# EAGLE design Teensy_Intan_Module_JE_T36_v01_20180628 (EAGLE 9.0.1)
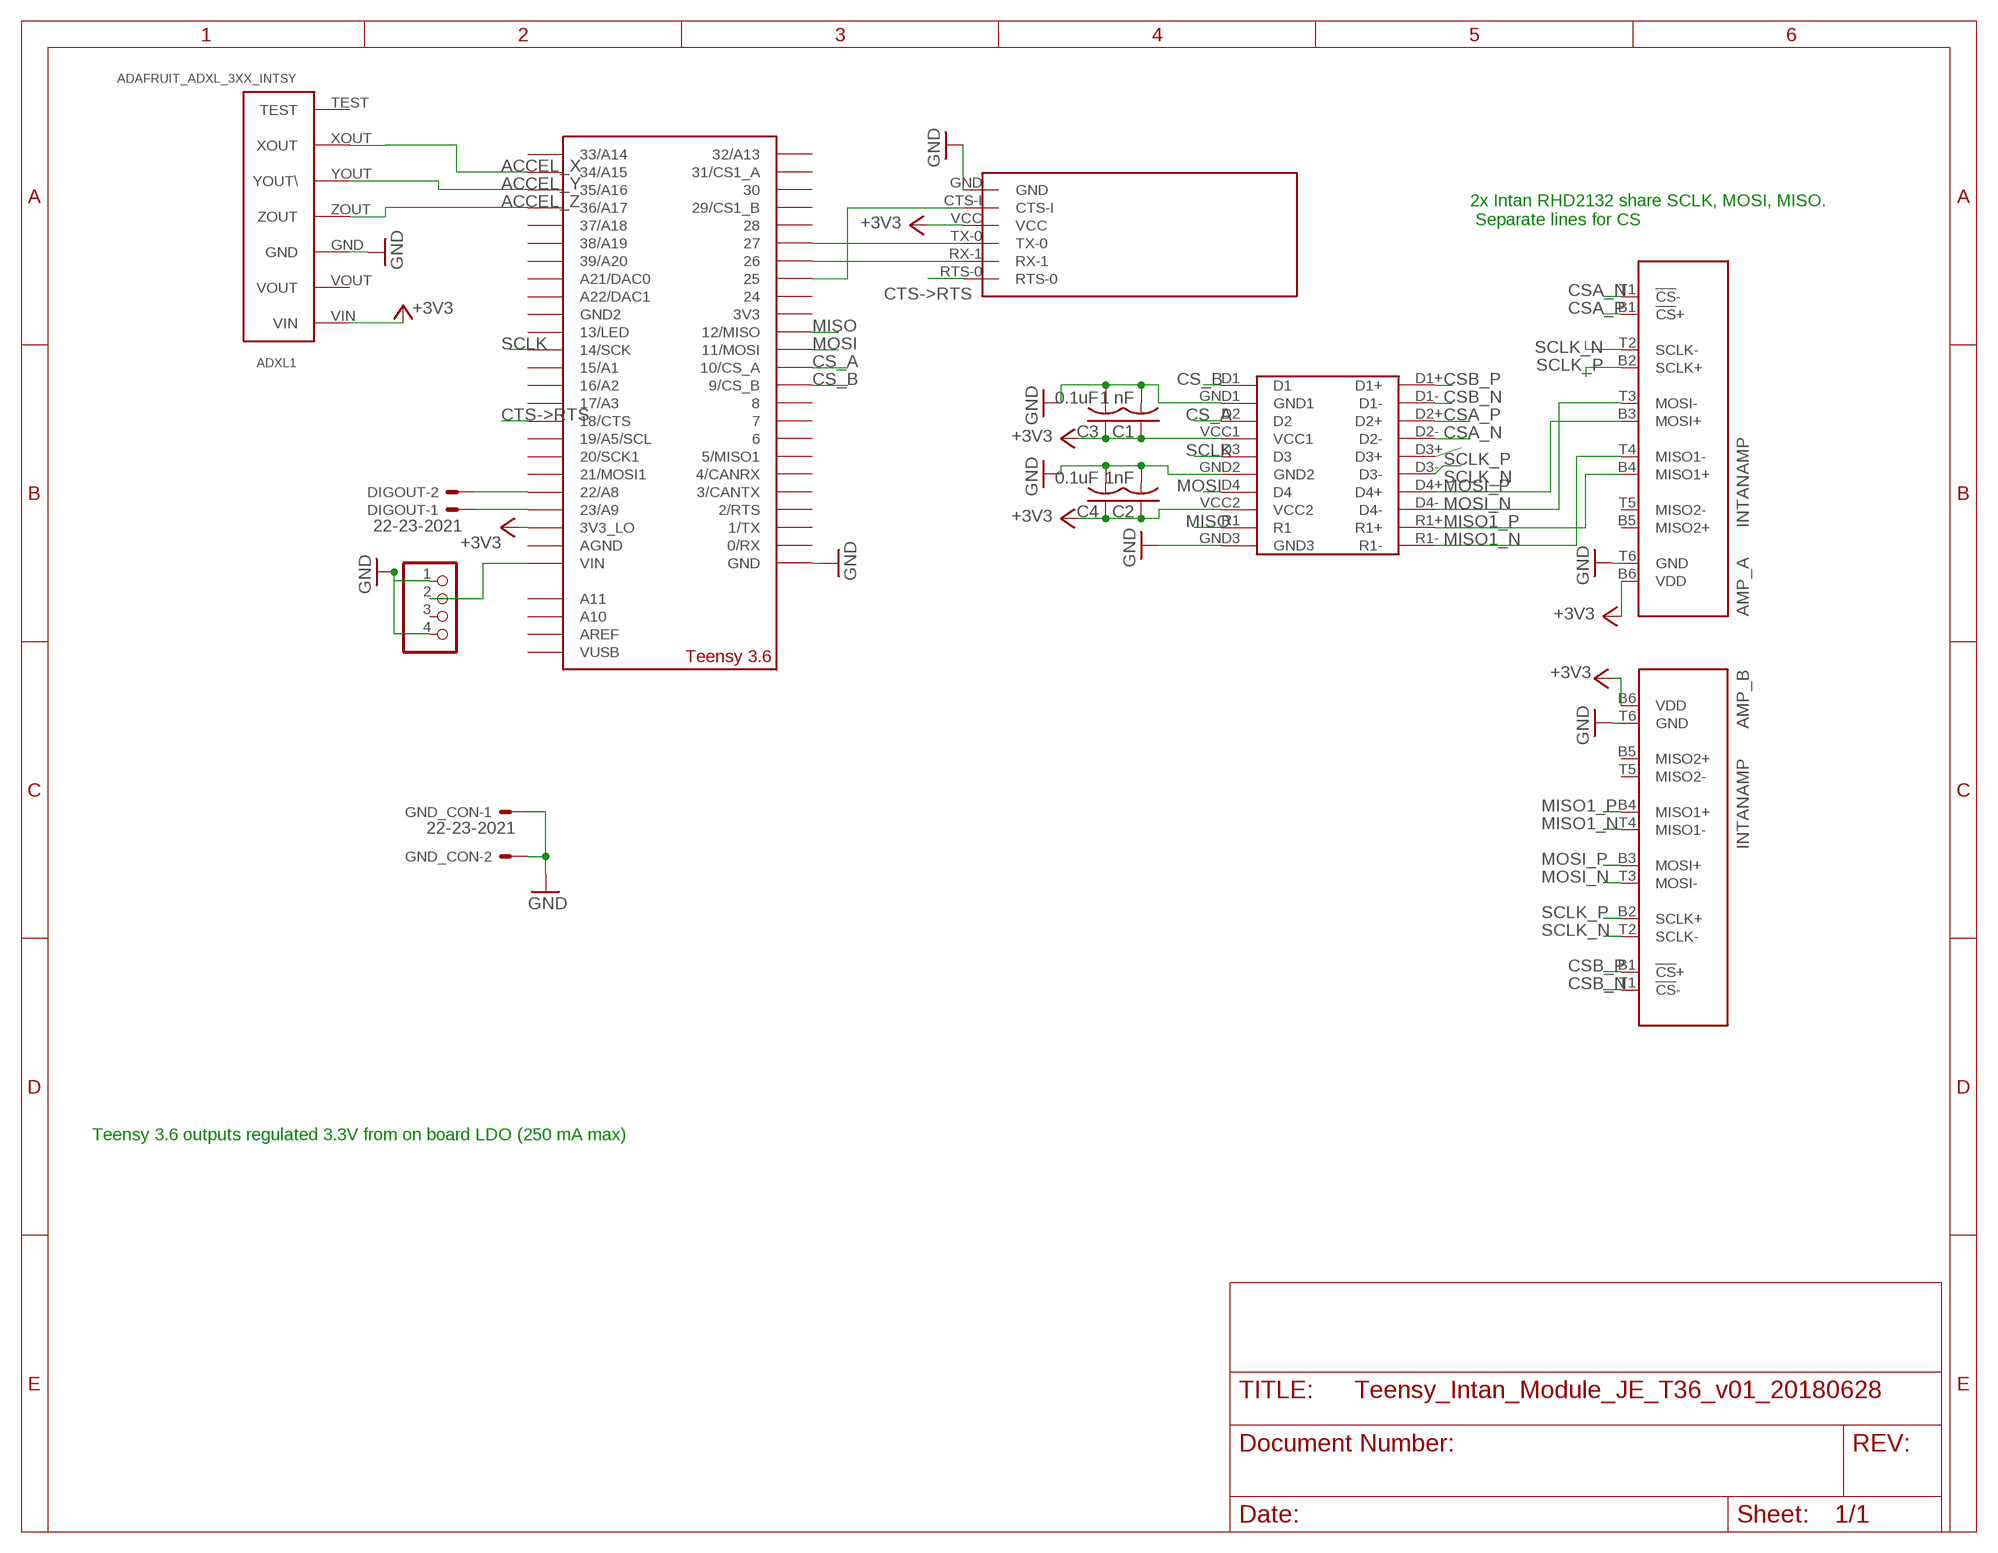
[diagram p0: schematic, sheet 1]

## Parts
ADXL1  ADAFRUIT_ADXL_3XX_INTSY  [ADAFRUIT_ADXL_3XX]
AMP_A  INTANAMP  [AMPBOARD]
AMP_B  INTANAMP  [AMPBOARD]
C1  1 nF  C-US025-024X044  [C025-024X044]
C2  1nF  C-US025-024X044  [C025-024X044]
C3  0.1uF  C-US025-024X044  [C025-024X044]
C4  0.1uF  C-US025-024X044  [C025-024X044]
DIGOUT  22-23-2021  [22-23-2021]
GND_CON  22-23-2021  [22-23-2021]
RN42  RN42  [RN42]
SW1  LiPoIn  PADS-4  [PADS-4]
U$1  SCHMARTBOARD20PIN  [SCHMARTBOARD20PIN]
U$2  TEENSY_3.5/3.6_BASIC  [TEENSY_3.5/3.6_BASIC]

## Nets
+3V3: ADXL1.VIN AMP_A.B6(VDD) AMP_B.B6(VDD) C1.1 C2.1 C3.1 C4.1 RN42.VCC U$1.VCC1 U$1.VCC2 U$2.3V3_LO
ACCEL_X: ADXL1.XOUT U$2.34/A15
ACCEL_Y: ADXL1.YOUT(YOUT\) U$2.35/A16
ACCEL_Z: ADXL1.ZOUT U$2.36/A17
CS_A: U$1.D2 U$2.10/CS(10/CS_A)
CS_B: U$1.D1 U$2.9/CS(9/CS_B)
CSA_N: AMP_A.T1(!CS!-) U$1.D2-
CSA_P: AMP_A.B1(!CS!+) U$1.D2+
CSB_N: AMP_B.T1(!CS!-) U$1.D1-
CSB_P: AMP_B.B1(!CS!+) U$1.D1+
CTS->RTS: RN42.RTS-0 U$2.18/A4/SDA(18/CTS)
GND: ADXL1.GND AMP_A.T6(GND) AMP_B.T6(GND) C1.2 C2.2 C3.2 C4.2 GND_CON.1 GND_CON.2 RN42.GND SW1.1 SW1.4 U$1.GND1 U$1.GND2 U$1.GND3 U$2.GND
MISO: U$1.R1 U$2.12/MISO
MISO1_N: AMP_A.T4(MISO1-) AMP_B.T4(MISO1-) U$1.R1-
MISO1_P: AMP_A.B4(MISO1+) AMP_B.B4(MISO1+) U$1.R1+
MOSI: U$1.D4 U$2.11/MOSI
MOSI_N: AMP_A.T3(MOSI-) AMP_B.T3(MOSI-) U$1.D4-
MOSI_P: AMP_A.B3(MOSI+) AMP_B.B3(MOSI+) U$1.D4+
N$1: SW1.2 U$2.VIN
N$3: DIGOUT.2 U$2.22/A8
N$4: DIGOUT.1 U$2.23/A9
N$5: RN42.TX-0 U$2.27
N$6: RN42.RX-1 U$2.26
N$7: RN42.CTS-I U$2.25
SCLK: U$1.D3 U$2.14/A0(14/SCK)
SCLK_N: AMP_A.T2(SCLK-) AMP_B.T2(SCLK-) U$1.D3-
SCLK_P: AMP_A.B2(SCLK+) AMP_B.B2(SCLK+) U$1.D3+
Unconnected: ADXL1.TEST ADXL1.VOUT AMP_A.B5(MISO2+) AMP_A.T5(MISO2-) AMP_B.B5(MISO2+) AMP_B.T5(MISO2-) SW1.3 U$2.0/RX U$2.1/TX U$2.2(2/RTS) U$2.3/CANTX U$2.3V3 U$2.4/CANRX U$2.5(5/MISO1) U$2.6 U$2.7 U$2.8 U$2.13/SCK(13/LED) U$2.15/A1 U$2.16/A2 U$2.17/A3 U$2.19/A5/SCL U$2.20/A6(20/SCK1) U$2.21/A7(21/MOSI1) U$2.21/DAC0(A21/DAC0) U$2.24 U$2.28 U$2.29(29/CS1_B) U$2.30 U$2.31/A12(31/CS1_A) U$2.32/A13 U$2.33/A14 U$2.37/A18 U$2.38/A19 U$2.39/A20 U$2.A10 U$2.A11 U$2.A22/DAC1 U$2.AGND U$2.AREF U$2.GND2 U$2.VUSB

## Notes on the sheet
- 2x Intan RHD2132 share SCLK, MOSI, MISO.
   Separate lines for CS
- Teensy 3.6 outputs regulated 3.3V from on board LDO (250 mA max)

## Library data of the parts
ADXL1 = adafruit_ADXL3xx_Intsy:ADAFRUIT_ADXL_3XX_INTSY: Bare bones 0.1" header row connector to plug in adafruit ADXL3xx module into a larger system (Intsy), for example, product 1018: https://www.adafruit.com/product/1018
AMP_A AMP_B = INTANAMP:INTANAMP
C1-C4 = adafruit:C-US: CAPACITOR, American symbol
DIGOUT GND_CON = con-molex:22-23-2021: .100" (2.54mm) Center Header - 2 Pin; MF: MOLEX; MPN: 22-23-2021; OC_FARNELL: 1462926; OC_NEWARK: 25C3832
RN42 = BLUETOOTH_MODULES:RN42
SW1 = breakouts:PADS-4: PIN HEADER
U$1 = schmart:SCHMARTBOARD20PIN
U$2 = Teensy356:TEENSY_3.5/3.6_BASIC

## Board
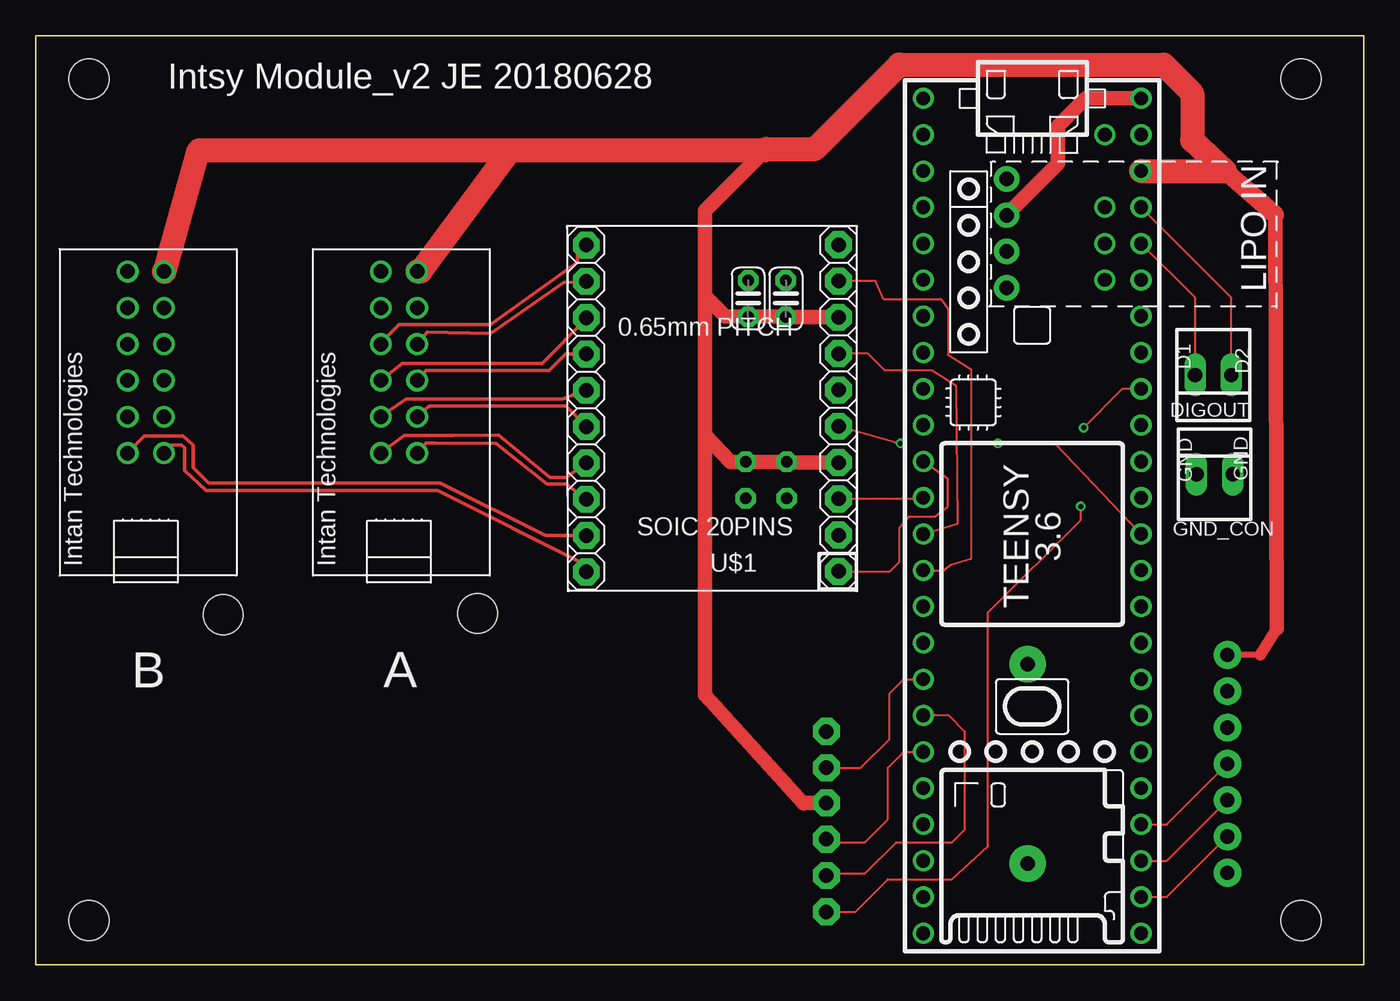
[diagram p1: board, top side]
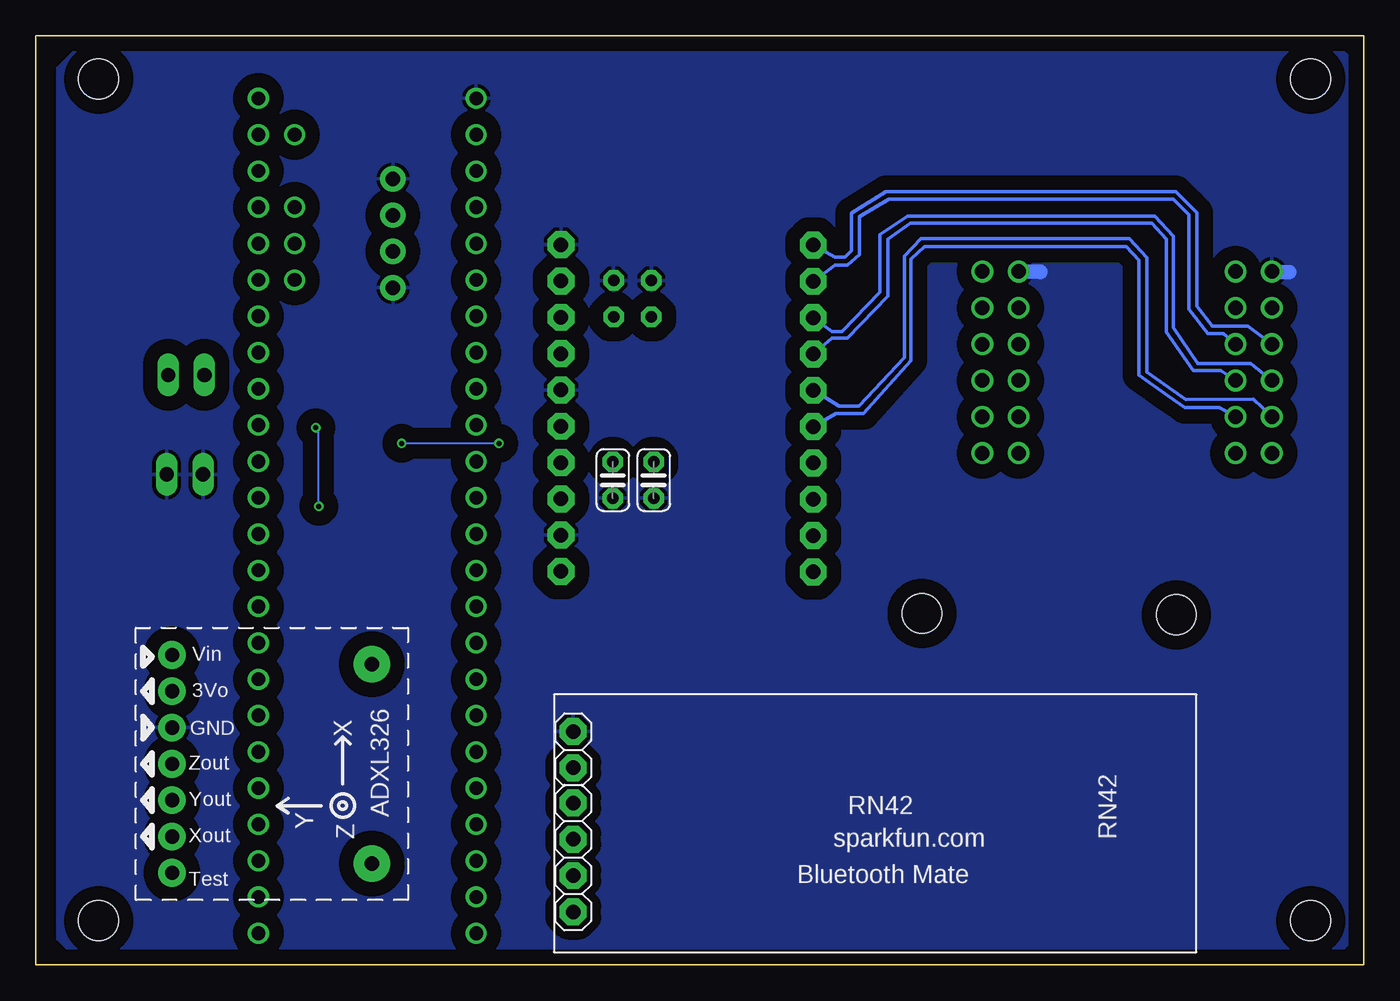
[diagram p2: board, bottom side, seen from below]

Size 92.91 x 65.01 mm. Coordinates in mm from the lower left corner, seen from the top.
Outline: 0,0 0,65.01 92.91,65.01 92.91,0 0,0
Copper layers (1*16): Top 0.035mm / dielectric 1.5mm / Bottom 0.035mm
Design rules "SeeedStudio_2layer_DRU_no_angle_20140221": minimum track width 6mil, minimum drill 12mil, track to track 6mil, track to pad 6mil, pad to pad 6mil, via to via 6mil, smd to smd 0mil, copper to edge 10mil, drill to drill 10mil, minimum pad ring 10mil, minimum via ring 6mil, stop-mask expansion 2mil, vias tented up to drill 100mil, thermal gap 10mil
Holes 2.8 mm at 30.91,24.59 13.11,24.49 3.71,61.99 3.71,3.09 88.51,3.09 88.51,61.99
tKeepout: area 1.8,60 to 5.7,63.9; area 86.6,59.9 to 90.5,63.8; area 1.9,1.1 to 5.8,5; area 86.6,1 to 90.5,4.9

### Footprints (pad centres in the part's own frame; a part is rotated, then mirrored left to right if it is on the bottom)
ADAFRUIT_ADXL_3XX = drill 1 pad 1.93: GND 6.985,2.54; TEST 17.145,2.54; VIN 1.905,2.54; VOUT 4.445,2.54; XOUT 14.605,2.54; YOUT 12.065,2.54; ZOUT 9.525,2.54 | drill 1 pad 2.54: P$1 2.54,16.51; P$2 16.51,16.51
AMPBOARD = drill 1.016: B1 -2.857,-2.857; B2 -2.857,-0.318; B3 -2.857,2.223; B4 -2.857,4.763; B5 -2.857,7.303; B6 -2.857,9.842; T1 -5.397,-2.857; T2 -5.397,-0.318; T3 -5.397,2.223; T4 -5.397,4.763; T5 -5.397,7.303; T6 -5.397,9.842
C025-024X044 = drill 0.813 pad 1.422 octagon: 1 -1.27,0; 2 1.27,0
22-23-2021 = drill 1 long: 1 -1.27,0; 2 1.27,0
RN42 = drill 1.016 pad 1.88 octagon: CTS-I -7.822,-23.538; GND -10.362,-23.538; RTS-0 2.258,-23.538; RX-1 -0.282,-23.538; TX-0 -2.822,-23.538; VCC -5.362,-23.538
PADS-4 = drill 1.016 pad 1.778: 1 -3.81,0; 2 -1.27,0; 3 1.27,0; 4 3.81,0
SCHMARTBOARD20PIN = drill 1.016 pad 1.88 octagon: D1 -5.715,12.675; D1+ 11.938,12.7; D1- 11.938,10.16; D2 -5.715,7.595; D2+ 11.938,7.62; D2- 11.938,5.08; D3 -5.715,2.515; D3+ 11.938,2.54; D3- 11.938,0; D4 -5.715,-2.565; D4+ 11.938,-2.54; D4- 11.938,-5.08; GND1 -5.715,10.135; GND2 -5.715,-0.025; GND3 -5.715,-10.185; R1 -5.715,-7.645; R1+ 11.938,-7.62; R1- 11.938,-10.16; VCC1 -5.715,5.055; VCC2 -5.715,-5.105
TEENSY_3.5/3.6_BASIC = drill 0.965: 0/RX -25.4,-7.62; 1/TX -22.86,-7.62; 2 -20.32,-7.62; 3/CANTX -17.78,-7.62; 3V3 7.62,-7.62; 3V3_LO -22.86,7.62; 4/CANRX -15.24,-7.62; 5 -12.7,-7.62; 6 -10.16,-7.62; 7 -7.62,-7.62; 8 -5.08,-7.62; 9/CS -2.54,-7.62; 10/CS 0,-7.62; 11/MOSI 2.54,-7.62; 12/MISO 5.08,-7.62; 13/SCK 5.08,7.62; 14/A0 2.54,7.62; 15/A1 0,7.62; 16/A2 -2.54,7.62; 17/A3 -5.08,7.62; 18/A4/SDA -7.62,7.62; 19/A5/SCL -10.16,7.62; 20/A6 -12.7,7.62; 21/A7 -15.24,7.62; 21/DAC0 12.7,7.62; 22/A8 -17.78,7.62; 23/A9 -20.32,7.62; 24 10.16,-7.62; 25 12.7,-7.62; 26 15.24,-7.62; 27 17.78,-7.62; 28 20.32,-7.62; 29 22.86,-7.62; 30 25.4,-7.62; 31/A12 27.94,-7.62; 32/A13 30.48,-7.62; 33/A14 30.48,7.62; 34/A15 27.94,7.62; 35/A16 25.4,7.62; 36/A17 22.86,7.62; 37/A18 20.32,7.62; 38/A19 17.78,7.62; 39/A20 15.24,7.62; A10 -17.78,5.08; A11 -15.24,5.08; A22/DAC1 10.16,7.62; AGND -25.4,7.62; AREF -20.32,5.08; GND -27.94,-7.62; GND2 7.62,7.62; VIN -27.94,7.62; VUSB -25.4,5.08

### Placement (x,y rotation side)
ADXL1  85.91,23.59 270 bottom
AMP_A  29.54,38.67 0 top
AMP_B  11.82,38.67 0 top
C1  49.68,33.92 270 bottom
C2  49.84,46.62 90 top
C3  52.54,33.92 270 bottom
C4  52.48,46.62 90 top
DIGOUT  82.38,41.27 180 top
GND_CON  82.48,34.32 0 top
RN42  31.77,5.97 270 bottom
SW1  67.91,51.19 270 top
U$1  50.45,40.2 180 top
U$2  69.71,32.69 270 top

### Tracks (layer width: path | path; a pad name or v marks a point on that pad's centre or on a via)
+3V3
  Top 0.152: 51.01,56.99 51.11,57.09
  Top 0.406: 85.67,21.68 ADXL1.VIN
  Top 0.813: 86.81,23.52 85.67,21.68
  Top 1.016: U$1.VCC1 52.59,35.15 C3.1 C1.1 48.61,35.19 46.81,37.09 | U$1.VCC2 52.83,45.31 C4.1 C2.1 48.25,45.35 46.81,46.79 | 46.81,37.09 46.81,46.79 | 46.81,46.79 46.81,52.79 51.11,57.09 | 46.81,37.09 46.81,18.89 53.71,11.29 53.75,11.33 RN42.VCC | 86.71,52.49 86.81,23.52
  Top 1.27: 83.21,55.55 86.71,52.49
  Top 1.676: AMP_B.B6 8.99,48.51 9.01,48.49 11.41,56.99 33.21,56.99 | AMP_A.B6 26.93,48.51 33.21,56.99 | 33.21,56.99 51.01,56.99 | 51.11,57.09 54.51,57.09 60.41,62.99 78.91,62.99 80.91,60.99 80.91,57.69 83.21,55.55 U$2.3V3_LO
ACCEL_X
  Top 0.152: U$2.34/A15 79.14,4.75 ADXL1.XOUT
ACCEL_Y
  Top 0.152: U$2.35/A16 79.14,7.29 ADXL1.YOUT
ACCEL_Z
  Top 0.152: U$2.36/A17 79.14,9.83 ADXL1.ZOUT
CS_A
  Top 0.152: U$2.10/CS 62.01,32.61 U$1.D2
CS_B
  Top 0.152: U$1.D1 59.75,27.53 60.41,28.19 60.41,30.59 61.11,31.39 62.91,31.39 63.81,32.09 63.81,34.01 U$2.9/CS
CSA_N
  Top 0.254: U$1.D2- 37.11,34.12 36,34.12 32.37,37.06 29.2,37.02 28.27,37.05 25.78,37.05 AMP_A.T1
CSA_P
  Top 0.254: AMP_A.B1 27.3,36.53 27.97,36.53 32.21,36.49 35.78,33.63 37.11,33.66 U$1.D2+
CSB_N
  Top 0.254: U$1.D1- 35.68,30.04 28.31,33.72 12.11,33.72 11.81,33.99 11.01,34.79 11.01,36.39 10.31,36.99 7.61,36.99 AMP_B.T1
CSB_P
  Top 0.254: U$1.D1+ 38.51,27.99 28.11,33.19 11.91,33.19 10.41,34.59 10.41,36.19 10.21,36.39 9.51,36.39 9.51,36.36 AMP_B.B1
CTS->RTS  (via drill 0.35)
  Top 0.152: RN42.RTS-0 57.33,3.71 59.61,5.99 64.11,5.99 66.62,8.29 66.62,24.65 73.11,31.14 v73.11,32.09 | v73.31,37.59 76.03,40.31 U$2.18/A4/SDA
  Bottom 0.152: v73.11,32.09 73.11,37.39 v73.31,37.59
GND
  Bottom 1.016: AMP_A.T6 22.64,48.51 22.61,48.49 | AMP_B.T6 6.41,48.49 5.21,48.49
  pour Bottom (isolate 1.016): 0.61,61.99 0.51,1.99 2.11,0.39 90.01,0.39 91.41,1.79 91.41,62.79 89.71,64.49 2.31,64.59 0.61,63.29
MISO
  Top 0.152: U$2.12/MISO 63.53,27.61 64.01,27.99 65.41,28.39 65.41,41.69 63.81,42.69 63.81,45.89 63.31,46.59 59.31,46.59 58.75,47.85 U$1.R1
MISO1_N
  Top 0.254: AMP_A.T4 24.05,43.43 25.41,44.79 31.81,44.79 32.21,45.09 37.86,49.13 37.91,49.19 37.91,49.76 U$1.R1-
  Bottom 0.254: AMP_B.T4 8.11,44.69 10.61,44.69 11.69,46.08 11.69,52.64 13.14,54.12 33.43,54.12 35.84,52.61 35.84,49.99 36.3,49.52 37.01,49.52 U$1.R1-
MISO1_P
  Top 0.254: AMP_A.B4 27.29,44.14 27.37,44.26 31.81,44.16 36.91,47.72 U$1.R1+
  Bottom 0.254: AMP_B.B4 9.81,44.19 10.91,44.19 12.24,45.9 12.24,52.49 13.31,53.59 33.21,53.59 35.28,52.37 35.28,49.68 36.13,48.96 37.01,48.96 U$1.R1+
MOSI
  Top 0.152: U$2.11/MOSI 64.51,30.87 64.41,40.49 62.71,41.59 59.41,41.59 58.21,42.79 56.19,42.79
  Top 0.254: 56.19,42.79 U$1.D4
MOSI_N
  Top 0.152: 38.51,45.19 U$1.D4-
  Top 0.254: AMP_A.T3 25.64,42.09 35.41,42.09 38.51,45.19
  Bottom 0.254: U$1.D4- 37.21,44.32 36.5,44.32 33.84,47.08 33.84,51.09 31.91,52.39 14.61,52.39 13.31,50.99 13.31,44.59 11.61,42.09 7.91,42.09 AMP_B.T3
MOSI_P
  Top 0.254: AMP_A.B3 26.61,40.89 27.31,41.59 35.91,41.59 37.07,42.74 U$1.D4+
  Bottom 0.254: U$1.D4+ 37.21,43.86 36.12,43.86 33.28,46.79 33.28,50.79 31.71,51.89 14.81,51.89 13.81,50.79 13.81,44.29 11.91,41.59 10.01,41.59 AMP_B.B3
N$1
  Top 1.016: SW1.2 71.51,56.06 71.51,58.69 73.45,60.63 U$2.VIN
N$3
  Top 0.152: DIGOUT.2 81.11,46.69 U$2.22/A8
N$4
  Top 0.152: DIGOUT.1 83.65,46.69 U$2.23/A9
N$5
  Top 0.152: RN42.TX-0 56.11,8.59 58.01,8.59 59.61,10.19 59.61,13.79 60.73,14.91 U$2.27
N$6
  Top 0.152: U$2.26 63.87,17.45 65.01,16.31 65.01,9.49 64.11,8.59 60.21,8.59 58.01,6.39 56.05,6.39 RN42.RX-1
N$7
  Top 0.152: RN42.CTS-I 57.71,13.79 59.71,15.79 59.71,18.99 60.71,19.99 U$2.25
SCLK  (via drill 0.35)
  Top 0.152: v67.31,36.49 71.29,36.49 U$2.14/A0 | U$1.D3 v60.51,36.49
  Bottom 0.152: v60.51,36.49 61.61,36.49 v67.31,36.49
SCLK_N
  Top 0.254: AMP_A.T2 25.91,39.59 33.11,39.59 36.84,39.61 U$1.D3-
  Bottom 0.254: U$1.D3- 36.71,39.12 35.31,39.12 32.14,42.48 32.14,49.59 31,50.82 16.4,50.81 15.18,49.47 15.19,41.49 12.46,39.56 7.71,39.59 AMP_B.T2
SCLK_P
  Top 0.254: AMP_A.B2 27.51,39.09 37.11,39.09 U$1.D3+
  Bottom 0.254: U$1.D3+ 36.91,38.56 35.01,38.56 31.68,42.3 31.68,49.39 30.73,50.26 16.62,50.26 15.74,49.3 15.74,41.28 13.66,39.82 12.51,38.99 10.11,38.99 AMP_B.B2

### Text on the board
tPlace: Intsy Module_v2 JE 20180628 | LIPO IN | D1 | D2 | GND | GND | B | A